# Altium schematic sheet Power.SchDoc
size A4
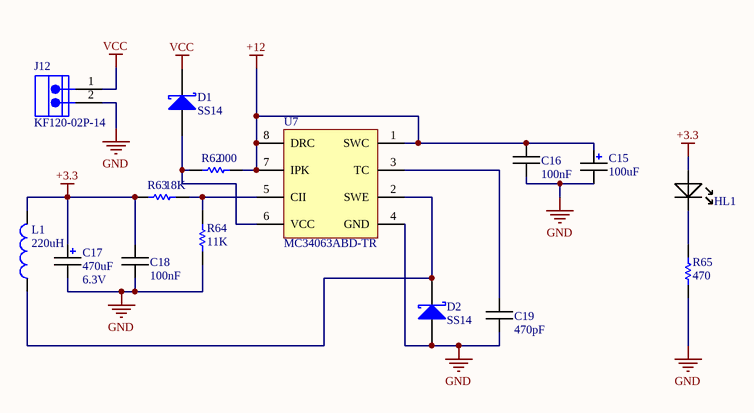
[diagram p0: Power.SchDoc]

## Parts
C15  Val: 100uF  [ECAP_SMD_6.3mmx5.4mm]  (hidden comment: CAP_ELEC_SMD)
C16  Val: 100nF  [CAP0805]  (hidden comment: CAP_SMD)
C17  Rated Capacitance: 470uF  Rated Voltage: 6.3V  [ECAP_SMD_8mmx10mm]  (hidden comment: CAP_ELEC_SMD)
C18  Val: 100nF  [CAPC1206(3216)170_L]  (hidden comment: CAP_SMD)
C19  Val: 470pF  [CAPC1206(3216)170_L]  (hidden comment: CAP_SMD)
D1  SS14  [DO-214]
D2  SS14  [DO-214]
HL1  LED_SMD  [0805_LED]  (value not drawn)
J12  KF120-02P-14  [DG301-5.0-02P-1X]
L1  220uH  [SDR1006_SMD]
R62  Val: 000  [RES0805]  (hidden comment: RES_SMD)
R63  Val: 18K  [RES0805]  (hidden comment: RES_SMD)
R64  Val: 11K  [RES0805]  (hidden comment: RES_SMD)
R65  Val: 470  [RES0805]  (hidden comment: RES_SMD)
U7  MC34063ABD-TR  [SO-8_M]

## Nets
+3.3: C17.1 C18.2 HL1.1(anode) L1.2 R63.1
+12: C15.1 C16.2 R62.2 U7.1(SWC) U7.7(IPK) U7.8(DRC)
GND: C15.2 C16.1 C17.2 C18.1 C19.1 D2.2(A) J12.2 R64.1 R65.1 U7.4(GND)
VCC: D1.1(K) J12.1
NetC19_2: C19.2 U7.3(TC)
NetD1_2: D1.2(A) R62.1 U7.6(VCC)
NetD2_1: D2.1(K) L1.1 U7.2(SWE)
NetHL1_2: HL1.2(cathode) R65.2
NetR63_2: R63.2 R64.2 U7.5(CII)

## Library data of the parts
C16 C18 C19 = CAP_SMD: Ceramic capacitor, 0805
D1 D2 = SS14: Schottky Rectifier, 1.1 W, -65 to 125 degC, 2-Pin SMD, RoHS, Tape and Reel; Manufacturer: Fairchild; Configuration: SINGLE; Diode Element Material: SILICON; Power Dissipation Limit-Max (W): 1.1; Additional Feature: FREEWHEELINGDIODE; Signal Diode Type: SIGNALDIODE; Number of Elements: 1; JEDEC-95 Code: DO-214AC; Rep Pk Reverse Voltage-Max (V): 40; Package Body Material: PLASTIC/EPOXY; CAGE Code: 1HBD3,07933,59621,7D893; Peak Reflow Temperature (Cel): 260; Package Shape: RECTANGULAR; Manufacturer URL: https://www.fairchildsemi.com/; JESD-97 Code: e3; Package Reference: DO-214AC-2; RoHS Compliant: YES; Package Description: 2-Pin Surface Mount Device, Body 4.375 x 2.725 mm; Technology: SCHOTTKY; Surface Mount: YES; Datasheet URL: http://www.onlinecomponents.com/datasheet/ss14.aspx?p=11369800; Terminal Form: CBEND; Package Style: SMALLOUTLINE; Number of Terminals: 2; JESD-30 Code: R-PDSO-C2; Average Forward Current-Max (A): 1; Terminal Finish: MATTETIN; Datasheet Version: Oct-13; Terminal Position: DUAL; Package URL: https://www.fairchildsemi.com/package-drawings/DO/DO214AC.pdf; Moisture Sensitivity Level: 1; Lead Free: YES
HL1 = LED_SMD: 0805 led
J12 = Terminal_2: Euro Terminal Block, 6 A, 150 V, -40 to 105 degC, Pitch 2.54 mm, 1x2 Position, Height 8.6 mm, Tail Length 3.3 mm; Manufacturer: Cixi KaiFeng; Rated Current: 6 A; Contact: Brass; Insulation Resistance: 5000 MOhm / 1000 V; Rated Voltage: 150 V; No. of Pole: 2; Withstanding Voltage: AC 1500 V / 1 Min; Contact Resistance: 20 mOhm; Pitch: Single Pitch; PackageReference: KF120-2; Color: Green; Mounting Technology: Through Hole; PartNumber: KF120-02P-14; PackageDescription: Terminal Block, Pitch 2.54 mm, 1 x 2 Position, Height 8.6 mm, Tail Length 3.3 mm; ComponentLink2Description: Datasheet; ComponentLink1Description: Manufacturer URL; ComponentLink2URL: http://www.nb-kaifeng.com/upload/editor/ext_pdf/201305290533202245.pdf; Temp. Range: -40 to 105 degC; ComponentLink1URL: http://www.nb-kaifeng.com/
L1 = Inductor power: Inductor for Power Circuits; Manufacturer: TDK; Online Catalog: VLCFSeries; Catalog Drawings: VLCF50[20,20-(1,3),28-2]SeriesTopVLCF50[20,20-(1,3),28-2]SeriesFootprintVLCF50[20,20-(1,3)]SeriesSide; Current - Saturation: 2.62A; Frequency - Test: 100kHz; EDA / CAD Models: DownloadfromAcceleratedDesigns; Material - Core: Ferrite; Type: Wirewound; DC Resistance (DCR): 43mOhmMax; Inductance: 2.2µH; Tolerance: ±30%; Shielding: Shielded; Other Names: 445-4557-1; Size / Dimension: 0.197"Lx0.197"W(5.00mmx5.00mm); Datasheet Version: 04/2016; Package Description: 2-Pin Surface Mount Device, Body 5 x 5 mm; Package Reference: VLCF5020T-3; Package / Case: Nonstandard; Series: VLCF; Current Rating: 2.62A; Manufacturer URL: http://www.tdk.com/; Category: Inductors,Coils,Chokes; Height - Seated (Max): 0.079"(2.00mm); Mounting Technology: SurfaceMount; Family: FixedInductors; Datasheet URL: https://product.tdk.com/info/en/catalog/datasheets/inductor_commercial_power_vlcf5020-3_en.pdf; Standard Package: 1; Mounting Type: SurfaceMount; Operating Temperature: -40°C~105°C; Packaging: CutTape(CT)
U7 = MC34063A: DC/DC converter control circuit, 8-Pin SO, Tape and Reel; PackageReference: SO8; DatasheetVersion: Nov-2007; PackageDescription: 8-Pin Small Outline Integrated Circuit 1.27 mm Pitch; ComponentLink3URL: http://www.st.com/internet/com/TECHNICAL_RESOURCES/TECHNICAL_LITERATURE/PACKAGE_INFORMATION/CD00004680.pdf; ComponentLink2Description: Datasheet; PackageVersion: Dec-2002; ComponentLink1URL: http://www.st.com; ComponentLink2URL: http://www.st.com/internet/com/TECHNICAL_RESOURCES/TECHNICAL_LITERATURE/DATASHEET/CD00001232.pdf; ComponentLink1Description: Manufacturer URL; ComponentLink3Description: Package Specification; Code_IPC: SOIC127P600-8; Code_JEDEC: MS-012-AA